# Altium schematic sheet PowerSupply.SchDoc
size A
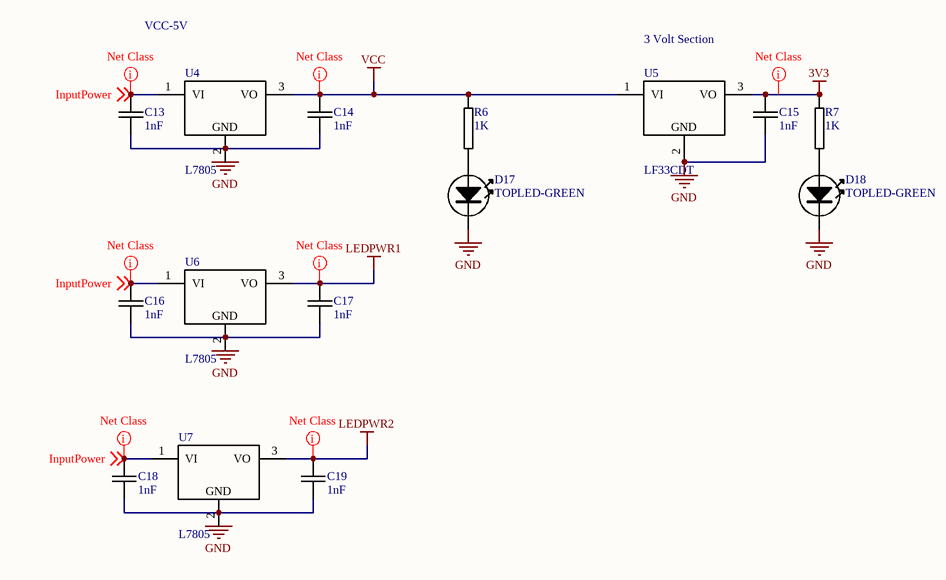
[diagram p0: PowerSupply.SchDoc]

## Parts
C13  1nF  [0603C-GENERIC]
C14  1nF  [0603C-GENERIC]
C15  1nF  [0603C-GENERIC]
C16  1nF  [0603C-GENERIC]
C17  1nF  [0603C-GENERIC]
C18  1nF  [0603C-GENERIC]
C19  1nF  [0603C-GENERIC]
D17  TOPLED-GREEN  [TOPLED-GREEN]
D18  TOPLED-GREEN  [TOPLED-GREEN]
R6  1K  [0603R-1k]
R7  1K  [0603R-1k]
U4  L7805  [DPAK]
U5  LF33CDT  [DPAK]
U6  L7805  [DPAK]
U7  L7805  [DPAK]

## Nets
3V3: C15.1 R7.1 U5.3(VO)
GND: C13.2 C14.2 C15.2 C16.2 C17.2 C18.2 C19.2 D17.K D18.K U5.2
LEDPWR1: C17.1 U6.3(VO)
LEDPWR2: C19.1 U7.3(VO)
VCC: C14.1 R6.1 U4.3(VO) U5.1(VI)
InputPower: C13.1 C16.1 C18.1 U4.1(VI) U6.1(VI) U7.1(VI) ; off-sheet InputPower
NetD17_A: D17.A R6.2
NetD18_A: D18.A R7.2

Not connected (* = marked no-connect by the designer): U4 2; U6 2; U7 2

## Layout directives
net class Power: 3V3, LEDPWR1, LEDPWR2, VCC
net class InputPower: InputPower

## Notes on the sheet
- VCC-5V
- 3 Volt Section
- (in symbol L7805-DPAK) GND
- (in symbol LF33CDT) GND

## Library data of the parts
C13-C19 = 0603C-000: CAPACITOR 0603 CERAMIC
R6 R7 = 0603R-1K: GENERIC RESISTOR 0603; Manufacturer Part Number: RMCF 1/16 1K 1% R; Manufacturer: Stackpole Electronics Inc; Reel: R14; Supplier 1: Digi-Key; Supplier Part Number 1: RMCF0603FT1K00TR-ND
U4 U6 U7 = L7805-DPAK: LINEAR REGULATOR 5.0V; Supplier 1: Digi-Key; Supplier Part Number 1: 497-7255-6-ND
U5 = LF33CDT: Low Drop Voltage Regulator 3.3V; Text Field1: ST; Text Field3: Mouser; Text Field4: 511-LF33CDT; Text Field6: 0.57; Text Field2: LF33CDT; Text Field5: DPAK; NI?: *; O?: *; Section:: *